# EAGLE design 14145^4 (EAGLE 7.6.0)
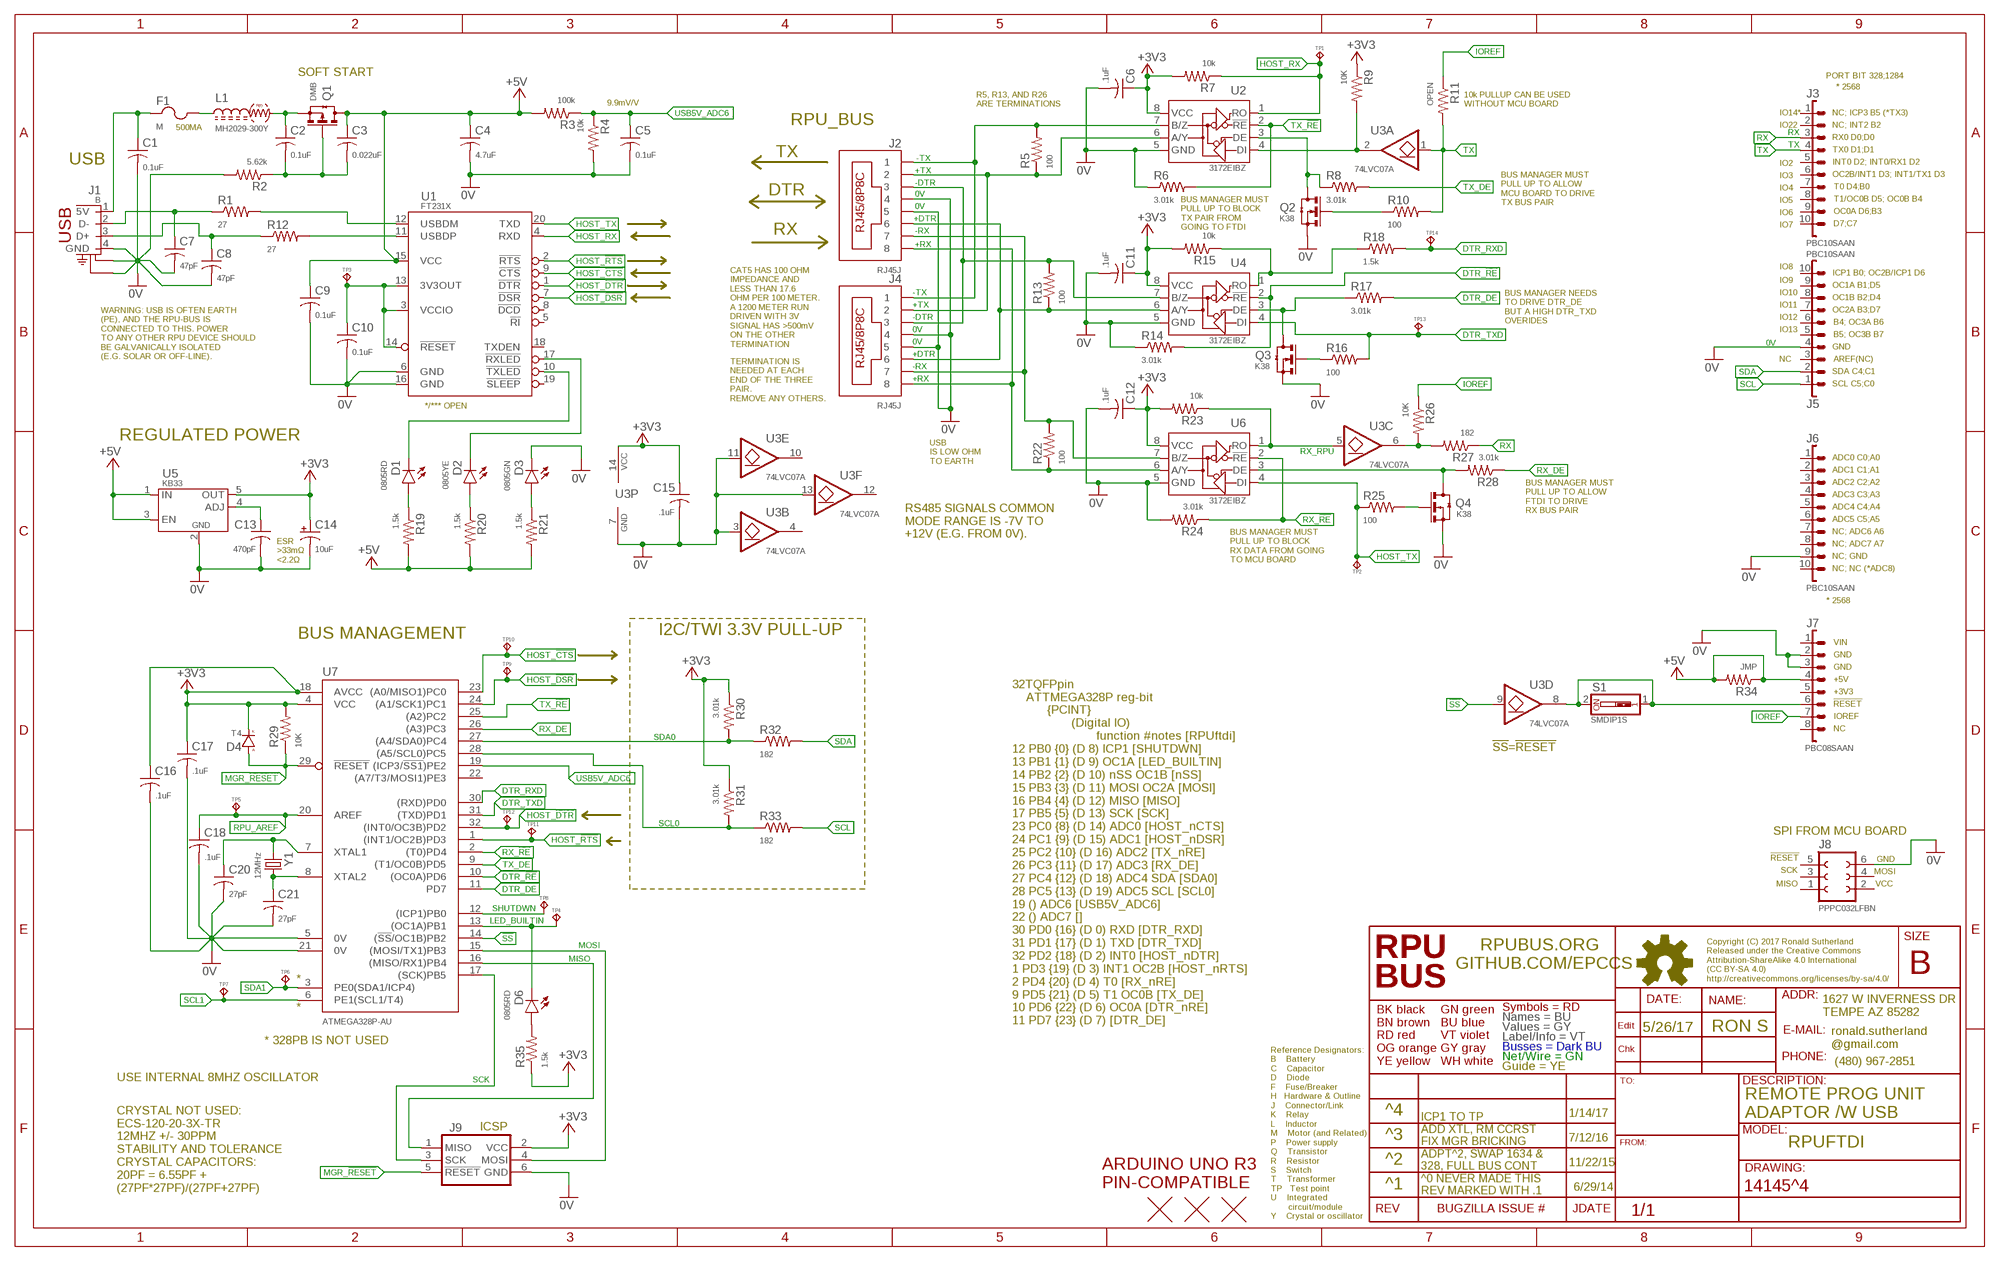
[diagram p0: schematic, sheet 1]

## Parts
C1  0.1uF  CC0603A  [C0603(1608)]
C2  0.1uF  CC0603A  [C0603(1608)]
C3  0.022uF  CC0603A  [C0603(1608)]
C4  4.7uF  CC1206  [C1206(3216)]
C5  0.1uF  CC0603A  [C0603(1608)]
C6  .1uF  CC0603A  [C0603(1608)]
C7  47pF  CC0603A  [C0603(1608)]
C8  47pF  CC0603A  [C0603(1608)]
C9  0.1uF  CC0603A  [C0603(1608)]
C10  0.1uF  CC0603A  [C0603(1608)]
C11  .1uF  CC0603A  [C0603(1608)]
C12  .1uF  CC0603A  [C0603(1608)]
C13  470pF  CC0603A  [C0603(1608)]
C14  10uF  CT1206  [3216]
C15  .1uF  CC0603A  [C0603(1608)]
C16  .1uF  CC0603A  [C0603(1608)]
C17  .1uF  CC0603A  [C0603(1608)]
C18  .1uF  CC0603A  [C0603(1608)]
C20  27pF  CC0603A  [C0603(1608)]
C21  27pF  CC0603A  [C0603(1608)]
D1  0805RD  LEDC0805(2012)  [C0805(2012)]
D2  0805YE  LEDC0805(2012)  [C0805(2012)]
D3  0805GN  LEDC0805(2012)  [C0805(2012)]
D4  T4  DSOD123  [SOD123]
D6  0805RD  LEDC0805(2012)  [C0805(2012)]
F1  M  SMD1210  [C1210(3225)]
J1  B  [USB-B-PTH]
J2  RJ45J  RJ45-8HZT  [RJ45-8HZT]
J3  PBC10SAAN  1X10"  [1X10]
J4  RJ45J  RJ45-8HZT  [RJ45-8HZT]
J5  PBC10SAAN  1X10"  [1X10]
J6  PBC10SAAN  1X10"  [1X10]
J7  PBC08SAAN  1X8"  [1X8]
J8  PPPC032LFBN  F2X3  [F2X3]
J9  ISP-SPIPTH  [ISP]
L1  MH2029-300Y  L0805  [C0805(2012)]
Q1  DMB  N-CHSOT23  [SOT23]
Q2  K38  N-CHSOT23  [SOT23]
Q3  K38  N-CHSOT23  [SOT23]
Q4  K38  N-CHSOT23  [SOT23]
R1  27  R0805  [C0805(2012)]
R2  5.62k  R0805  [C0805(2012)]
R3  100k  R0805  [C0805(2012)]
R4  10k  R0805  [C0805(2012)]
R5  100  R0805  [C0805(2012)]
R6  3.01k  R0805  [C0805(2012)]
R7  10k  R0805  [C0805(2012)]
R8  3.01k  R0805  [C0805(2012)]
R9  10K  R0805  [C0805(2012)]
R10  100  R0805  [C0805(2012)]
R11  OPEN  R0805  [C0805(2012)]
R12  27  R0805  [C0805(2012)]
R13  100  R0805  [C0805(2012)]
R14  3.01k  R0805  [C0805(2012)]
R15  10k  R0805  [C0805(2012)]
R16  100  R0805  [C0805(2012)]
R17  3.01k  R0805  [C0805(2012)]
R18  1.5k  R0805  [C0805(2012)]
R19  1.5k  R0805  [C0805(2012)]
R20  1.5k  R0805  [C0805(2012)]
R21  1.5k  R0805  [C0805(2012)]
R22  100  R0805  [C0805(2012)]
R23  10k  R0805  [C0805(2012)]
R24  3.01k  R0805  [C0805(2012)]
R25  100  R0805  [C0805(2012)]
R26  10K  R0805  [C0805(2012)]
R27  182  R0805  [C0805(2012)]
R28  3.01k  R0805  [C0805(2012)]
R29  10K  R0805  [C0805(2012)]
R30  3.01k  R0805  [C0805(2012)]
R31  3.01k  R0805  [C0805(2012)]
R32  182  R0805  [C0805(2012)]
R33  182  R0805  [C0805(2012)]
R34  JMP  R0805  [C0805(2012)]
R35  1.5k  R0805  [C0805(2012)]
S1  SMDIP1S  SW_DIP-1SMD  [SMD-DIPSWITCH-1]
TP1  TPPAD1-08  [P1-08]
TP2  TPPAD1-08  [P1-08]
TP3  TPPAD1-08  [P1-08]
TP4  TPPAD1-08  [P1-08]
TP5  TPPAD1-08  [P1-08]
TP6  TPPAD1-08  [P1-08]
TP7  TPPAD1-08  [P1-08]
TP8  TPPAD1-08  [P1-08]
TP9  TPPAD1-08  [P1-08]
TP10  TPPAD1-08  [P1-08]
TP11  TPPAD1-08  [P1-08]
TP12  TPPAD1-08  [P1-08]
TP13  TPPAD1-08  [P1-08]
TP14  TPPAD1-08  [P1-08]
U1  FT231X  [20SSOP]
U2  3172EIBZ  ISL3172EIBZ  [SOIC8]
U3  74LVC07A  7407D  [14SOIC]
U4  3172EIBZ  ISL3172EIBZ  [SOIC8]
U5  KB33  MIC5205  [SOT23-5,SOT25]
U6  3172EIBZ  ISL3172EIBZ  [SOIC8]
U7  ATMEGA328P-AU  ATMEGA328PB-AU  [TQFP32-08]
U$1  ARDUINO-UNO  [ARDUINO_UNO]
U$2  FIDUCIAL1.27  [FIDUCIAL-1.27]
U$3  FIDUCIAL1.27  [FIDUCIAL-1.27]
U$4  FIDUCIAL1.27  [FIDUCIAL-1.27]
Y1  12MHz  CSM-3X  [CSM-3X]

## Nets
0V: C1.2 C4.2 C5.2 C6.2 C7.2 C8.2 C9.2 C10.2 C11.2 C12.2 C13.2 C14.- C15.2 C16.2 C17.2 C18.2 C20.2 C21.2 D3.K J1.4(GND) J1.S1(CHASSIS1) J1.S2(CHASSIS2) J2.4 J2.5 J4.4 J4.5 J5.4 J6.9 J7.2 J7.3 J8.6 J9.6(GND) Q2.2(S)(S) Q3.2(S)(S) Q4.2(S)(S) R2.2 R4.2 R6.1 R14.1 R24.2 U1.6(GND) U1.16(GND) U2.5(GND) U3.3(B:I) U3.7(P:GND) U3.11(E:I) U3.13(F:I) U4.5(GND) U5.2(GND) U6.5(GND) U7.5(0V) U7.21(0V)
!SS!: U3.9(D:I) U7.14((!SS!/OC1B)PB2)
+3V3: C6.1 C11.1 C12.1 C14.+ C15.1 C16.1 C17.1 D4.C(K) J9.2(VCC) R7.2 R9.1 R15.2 R23.2 R29.2 R30.1 R31.1 R35.1 U2.8(VCC) U3.14(P:VCC) U4.8(VCC) U5.5(OUT) U6.8(VCC) U7.4(VCC) U7.18(AVCC)
+5V: C3.1 C4.1 C9.1 J7.4 Q1.3(D)(D) R3.2 R19.2 R20.2 R21.2 R34.1 R34.2 U1.15(VCC) U5.1(IN) U5.3(EN)
+DTR: J2.6 J4.6 R13.1 U4.6(A/Y)
+RX: J2.8 J4.8 R22.1 U6.6(A/Y)
+TX: J2.2 J4.2 R5.1 U2.6(A/Y)
-DTR: J2.3 J4.3 R13.2 U4.7(B/Z)
-RX: J2.7 J4.7 R22.2 U6.7(B/Z)
-TX: J2.1 J4.1 R5.2 U2.7(B/Z)
D+: C8.1 J1.3(D+) R12.1
D-: C7.1 J1.2(D-) R1.1
DTR_!RE: R14.2 U4.2(!RE) U7.10((OC0A)PD6)
DTR_DE: R17.2 U7.11(PD7)
DTR_RXD: R18.2 TP14.TP U7.30((RXD)PD0)
DTR_TXD: R16.2 TP13.TP U4.4(DI) U7.31((TXD)PD1)
FT3V3: C10.1 TP3.TP U1.3(VCCIO) U1.13(3V3OUT) U1.14(!RESET!)
HOST_!CTS: TP10.TP U1.9(!CTS!) U7.23((A0/MISO1)PC0)
HOST_!DSR: TP9.TP U1.7(!DSR!) U7.24((A1/SCK1)PC1)
HOST_!DTR: TP12.TP U1.1(!DTR!) U7.32((INT0/OC3B)PD2)
HOST_!RTS: TP11.TP U1.2(!RTS!) U7.1((INT1/OC2B)PD3)
HOST_RX: R7.1 TP1.TP U1.4(RXD) U2.1(RO)
HOST_TX: R25.1 TP2.TP U1.20(TXD) U6.4(DI)
IOREF: J7.7 R11.1 R26.1
LED_BUILTIN: D6.K TP4.TP U7.13((OC1A)PB1)
MGR_!RESET: D4.A J9.5(!RESET) R29.1 U7.29(!RESET)
MISO: J9.1(MISO) U7.16((MISO/RX1)PB4)
MOSI: J9.4(MOSI) U7.15((MOSI/TX1)PB3)
N$3: J7.6 S1.1 S1.2 U3.8(D:O)
N$4: C1.1 F1.1 J1.1(5V)
N$5: F1.2 L1.1
N$6: D2.A R20.1
N$7: D1.K U1.10(!TXLED)
N$8: D2.K U1.17(!RXLED)
N$10: R26.2 R27.2 U3.6(C:O)
N$11: Q4.3(D)(D) R28.2 U6.3(DE)
N$12: R1.2 U1.12(USBDM)
N$13: R12.2 U1.11(USBDP)
N$14: D3.A R21.1
N$15: Q2.1(G)(G) R10.1
N$16: D1.A R19.1
N$18: Q2.3(D)(D) R8.1 U2.3(DE)
N$19: R15.1 R18.1 U4.1(RO)
N$20: Q3.3(D)(D) R17.1 U4.3(DE)
N$22: Q3.1(G)(G) R16.1
N$24: C13.1 U5.4(ADJ)
N$25: Q4.1(G)(G) R25.2
N$26: C2.1 L1.2 Q1.2(S)(S)
N$27: C2.2 C3.2 Q1.1(G)(G) R2.1
N$29: D6.A R35.2
RPU_AREF: C18.1 TP5.TP U7.20(AREF)
RX: J3.3 R27.1
RX_!RE: R24.1 U6.2(!RE) U7.2((T0)PD4)
RX_DE: R28.1 U7.26((A3)PC3)
RX_RPU: R23.1 U3.5(C:I) U6.1(RO)
SCK: J9.3(SCK) U7.17((SCK)PB5)
SCL: J5.1 R33.2
SCL0: R31.2 R33.1 U7.28((A5/SCL0)PC5)
SCL1: TP7.TP U7.6(PE1(SCL1/T4))
SDA: J5.2 R32.2
SDA0: R30.2 R32.1 U7.27((A4/SDA0)PC4)
SDA1: TP6.TP U7.3(PE0(SDA1/ICP4))
SHUTDWN: TP8.TP U7.12((ICP1)PB0)
TX: J3.4 R10.2 R11.2 U3.1(A:I)
TX_!RE: R6.2 U2.2(!RE) U7.25((A2)PC2)
TX_DE: R8.2 U7.9((T1/OC0B)PD5)
TX_RPU: R9.2 U2.4(DI) U3.2(A:O)
USB5V_ADC6: C5.1 R3.1 R4.1 U7.19((ICP3/!SS1!)PE2)
XTAL1: C20.1 U7.7(XTAL1) Y1.1
XTAL2: C21.1 U7.8(XTAL2) Y1.2
Unconnected: J3.1 J3.2 J3.5 J3.6 J3.7 J3.8 J3.9 J3.10 J5.3 J5.5 J5.6 J5.7 J5.8 J5.9 J5.10 J6.1 J6.2 J6.3 J6.4 J6.5 J6.6 J6.7 J6.8 J6.10 J7.1 J7.5 J7.8 J8.1 J8.2 J8.3 J8.4 J8.5 U1.5(!RI!) U1.8(!DCD!) U1.18(TXDEN) U1.19(!SLEEP) U3.4(B:O) U3.10(E:O) U3.12(F:O) U7.22((A7/T3/MOSI1)PE3)

## Notes on the sheet
- SOFT START
- PORT BIT 328;1284
- * 2568
- 9.9mV/V
- R5, R13, AND R26
  ARE TERMINATIONS
- 10k PULLUP CAN BE USED 
  WITHOUT MCU BOARD
- IO14* | NC; ICP3 B5 (*TX3)
- RPU_BUS | IO22 | NC; INT2 B2
- 500MA
- RX0 D0;D0
- TX0 D1;D1
- TX
- USB | IO2 | INT0 D2; INT0/RX1 D2
- IO3 | OC2B/INT1 D3; INT1/TX1 D3
- IO4 | T0 D4;B0
- DTR
- IO5 | T1/OC0B D5; OC0B B4
- BUS MANAGER MUST
  PULL UP TO ALLOW 
  MCU BOARD TO DRIVE
  TX BUS PAIR
- IO6 | OC0A D6;B3
- IO7 | D7;C7
- BUS MANAGER MUST
  PULL UP TO BLOCK 
  TX PAIR FROM 
  GOING TO FTDI
- RX
- IO8
- ICP1 B0; OC2B/ICP1 D6
- IO9
- OC1A B1;D5
- IO10
- OC1B B2;D4
- IO11
- OC2A B3;D7
- IO12
- BUS MANAGER NEEDS
  TO DRIVE DTR_DE
  BUT A HIGH DTR_TXD
  OVERIDES
- B4; OC3A B6
- IO13
- B5; OC3B B7
- CAT5 HAS 100 OHM 
  IMPEDANCE AND 
  LESS THAN 17.6 
  OHM PER 100 METER. 
  A 1200 METER RUN
  DRIVEN WITH 3V 
  SIGNAL HAS >500mV
  ON THE OTHER
  TERMINATION
- GND
- WARNING: USB IS OFTEN EARTH 
  (PE), AND THE RPU-BUS IS 
  CONNECTED TO THIS. POWER 
  TO ANY OTHER RPU DEVICE SHOULD
  BE GALVANICALLY ISOLATED 
  (E.G. SOLAR OR OFF-LINE).
- NC | AREF(NC)
- SDA C4;C1
- SCL C5;C0
- TERMINATION IS 
  NEEDED AT EACH
  END OF THE THREE 
  PAIR.
  REMOVE ANY OTHERS.
- */*** OPEN
- REGULATED POWER
- ADC0 C0;A0
- USB
  IS LOW OHM
  TO EARTH
- ADC1 C1;A1
- ADC2 C2;A2
- ADC3 C3;A3
- ADC4 C4;A4
- BUS MANAGER MUST
  PULL UP TO ALLOW 
  FTDI TO DRIVE
  RX BUS PAIR
- ADC5 C5;A5
- NC; ADC6 A6
- RS485 SIGNALS COMMON 
  MODE RANGE IS -7V TO 
  +12V (E.G. FROM 0V).
- NC; ADC7 A7
- NC; GND
- ESR
  >33mΩ
  <2.2Ω
- BUS MANAGER MUST
  PULL UP TO BLOCK 
  RX DATA FROM GOING
  TO MCU BOARD
- NC; NC (*ADC8)
- * 2568
- BUS MANAGEMENT | I2C/TWI 3.3V PULL-UP
- VIN
- GND
- GND
- +5V
- +3V3
- !RESET
- IOREF
- NC
- !SS!=!RESET!
- SPI FROM MCU BOARD
- !RESET
- GND
- SCK
- MOSI
- MISO
- VCC
- *
- *
- 32TQFPpin
      ATTMEGA328P reg-bit
            {PCINT}
                   (Digital IO)
                          function #notes [RPUftdi]
  12 PB0 {0} (D 8) ICP1 [SHUTDWN]
  13 PB1 {1} (D 9) OC1A [LED_BUILTIN]
  14 PB2 {2} (D 10) nSS OC1B [nSS]
  15 PB3 {3} (D 11) MOSI OC2A [MOSI]
  16 PB4 {4} (D 12) MISO [MISO]
  17 PB5 {5} (D 13) SCK [SCK]
  23 PC0 {8} (D 14) ADC0 [HOST_nCTS]
  24 PC1 {9} (D 15) ADC1 [HOST_nDSR]
  25 PC2 {10} (D 16) ADC2 [TX_nRE]
  26 PC3 {11} (D 17) ADC3 [RX_DE]
  27 PC4 {12} (D 18) ADC4 SDA [SDA0]
  28 PC5 {13} (D 19) ADC5 SCL [SCL0]
  19 () ADC6 [USB5V_ADC6]
  22 () ADC7 []
  30 PD0 {16} (D 0) RXD [DTR_RXD]
  31 PD1 {17} (D 1) TXD [DTR_TXD]
  32 PD2 {18} (D 2) INT0 [HOST_nDTR]
  1 PD3 {19} (D 3) INT1 OC2B [HOST_nRTS]
  2 PD4 {20} (D 4) T0 [RX_nRE]
  9 PD5 {21} (D 5) T1 OC0B [TX_DE]
  10 PD6 {22} (D 6) OC0A [DTR_nRE]
  11 PD7 {23} (D 7) [DTR_DE]
- 5/26/17 | RON S
- * 328PB IS NOT USED
- USE INTERNAL 8MHZ OSCILLATOR
- ^4 | 1/14/17
- REMOTE PROG UNIT
  ADAPTOR /W USB
- ICP1 TO TP
- ICSP
- ^3 | 7/12/16
- ADD XTL, RM CCRST
  FIX MGR BRICKING
- RPUFTDI
- ^2 | 11/22/15
- ADPT^2, SWAP 1634 &
  328, FULL BUS CONT
- ^1 | 6/29/14
- CRYSTAL NOT USED:
  ECS-120-20-3X-TR 
  12MHZ +/- 30PPM
  STABILITY AND TOLERANCE
  CRYSTAL CAPACITORS:
  20PF = 6.55PF +
  (27PF*27PF)/(27PF+27PF)
- ^0 NEVER MADE THIS
  REV MARKED WITH .1

## Library data of the parts
C1-C13 C15-C18 C20 C21 = C-C:C: CAPACITOR Symbol
C14 = C-T:CT: Tantalum Electrolytic Capacitor
D1-D3 D6 = D-LED:LED: LED 120120WH [CREE,XHGAWT-00-0000-00000HXE1] LED WHITE 6500K 150LUM-W120120
D4 = D-GP:D: DIODE
F1 = F-RST:SMD: Fuse i.e. Bourns, MF-USMF075-2
J1 = J-USB:B: B [MOLEX,0670688000] USB B THROUGH HOLE
J2 J4 = J-RJ45:RJ45-8: RJ45 Jack RJ45J [ASSMANN,A-2014-2-4-R] JACK MODULAR VERT PCB 8P8C UNSHIELD Horz version form sparkfun sku PRT-00643, and breakout board sku is BOB-00716.
J3 J5 J6 = J-HDR2.54mm:1X10: 10 POS HEADER PBC10S [SULLINS,PBC10SAAN]HEADER MALE BRKWAY 10POS .1IN AA
J7 = J-HDR2.54mm:1X8: 8 POS HEADER PBC08SAAN [SULLINS,PBC08SAAN]HEADER MALE BRKWAY 8POS .1IN AA
J8 = J-HDR2.54mm:F2X3: FEMALE HEADER 2X3POS
J9 = U-AVR:ISP-SPI: AVR ISP thru SPI In-System Programming uses the target Atmel AVR’s internal SPI (Serial Peripheral Interface) to download code into the flash and EEPROM memories. It is not a debugging interface. When designing an application PCB which includes an AVR with the SPI interface, this pinout should be used. Sparkfun SKU: BOB-08508
L1 = L-FB:L: Ferrite Bead with frequency dependent resistance
Q1 = Q-PCH:N-CH?*: ENHANCEMENT MODE MOSFET SOT23 is BSS138 pinout
Q2-Q4 = Q-NCH:N-CH?*: ENHANCEMENT MODE MOSFET SOT23 is BSS138 pinout
R1-R35 = R-C:R: Resiistor American-style symbol
S1 = S-Toggle:SW_DIP-1
TP1-TP14 = J-TP:TP: Test pad
U1 = U-Transceiver:FT231X
U2 U4 U6 = U-Transceiver:ISL3172E: TRANSCEIVER RS485 3.3V HALFDPLX
U3 = U-7400:74*07: HEX BUFFER, OPEN DRAIN/COLLECTOR 74LVC07A [DIODES,74LVC07AS14-13] LOGIC BUFFER OPEN DRAIN 14SOIC
U5 = P-DCDC:MIC5205: KB33 [MICREL,MIC5205-3.3YM5] REG ULDO 3V3 150MA SOT23-5
U7 = U-AVR:ATMEGA328PB-AU: ATmega328PB 4 Kbytes FLASH 128 bytes SRAM 256 bytes EEPROM 2 UART, 2 I2C, 2 SPI 8-channel 10 bit ADC
U$1 = J-BoardHDR:ARDUINO-UNO: Board Outline with holes and silk note the board dim layer is not defined
U$2-U$4 = H-Fiducial:FIDUCIAL: Fiducial Alignment Points Various fiducial points for machine vision alignment.
Y1 = Y-XTL:CSM: 16MHZ20 [ECS,ECS-160-20-3X-TR] CRYSTAL 16MHZ 20PF 30PPM CSM-3X

## Net classes
0 default: width 0.254 mm, drill 0.33 mm

## Board
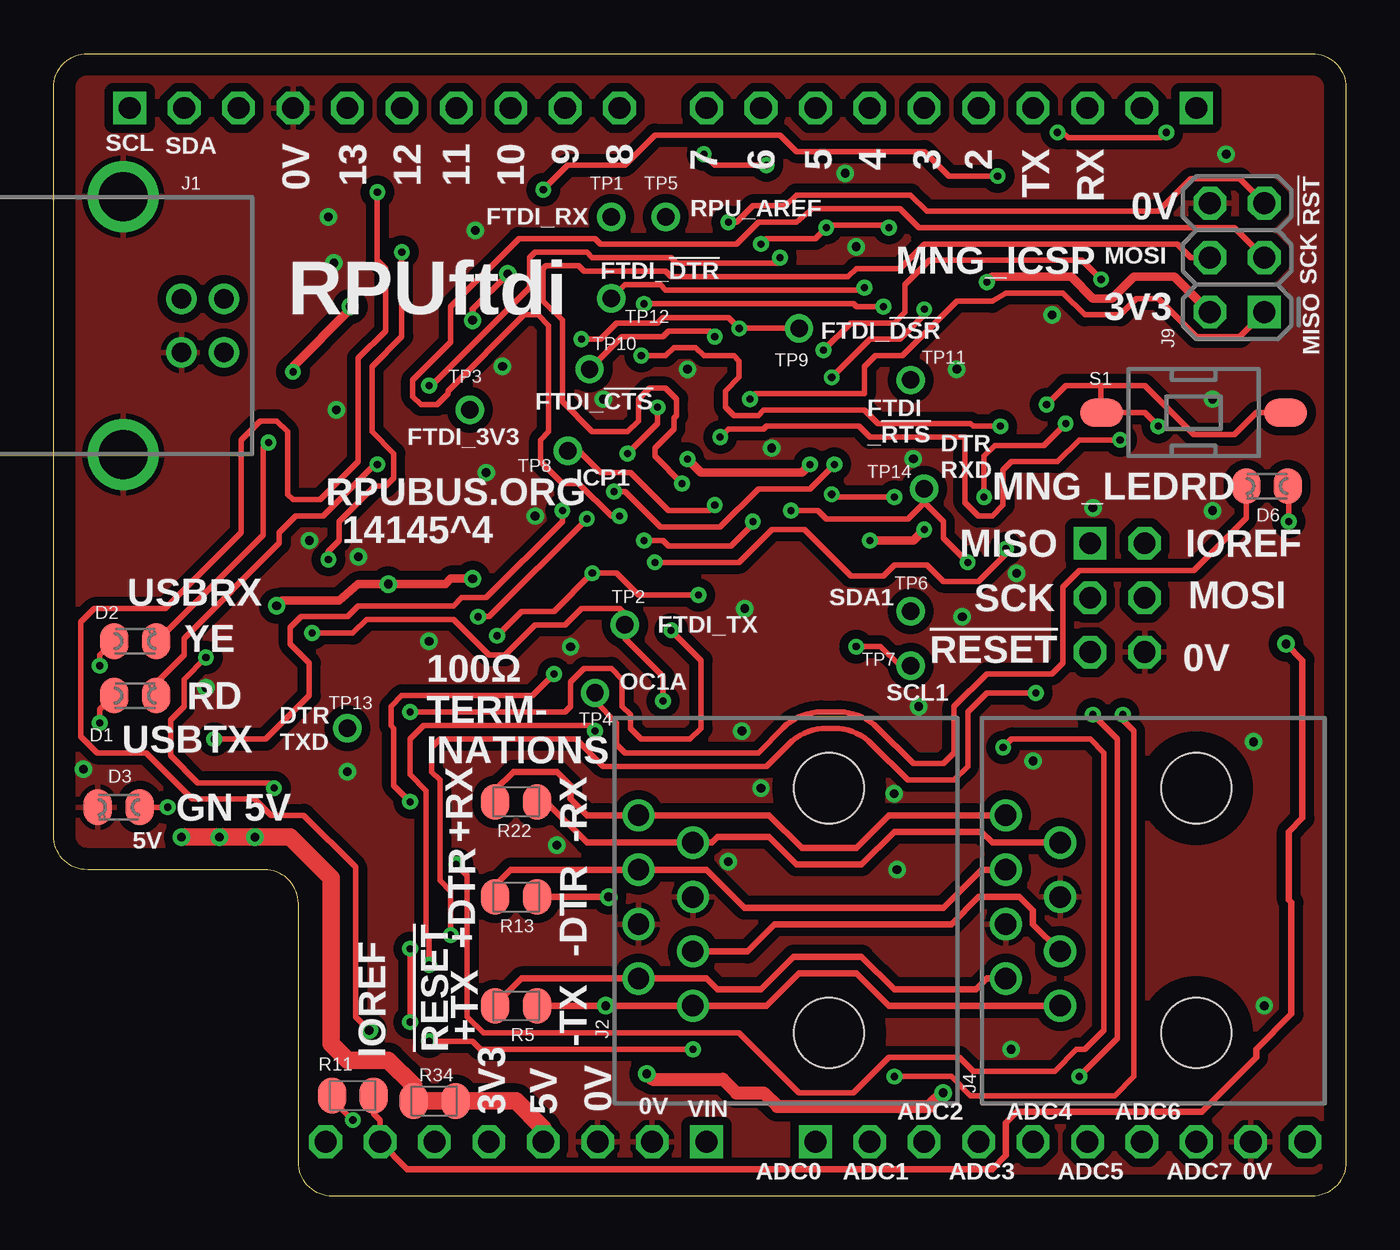
[diagram p1: board, top side]
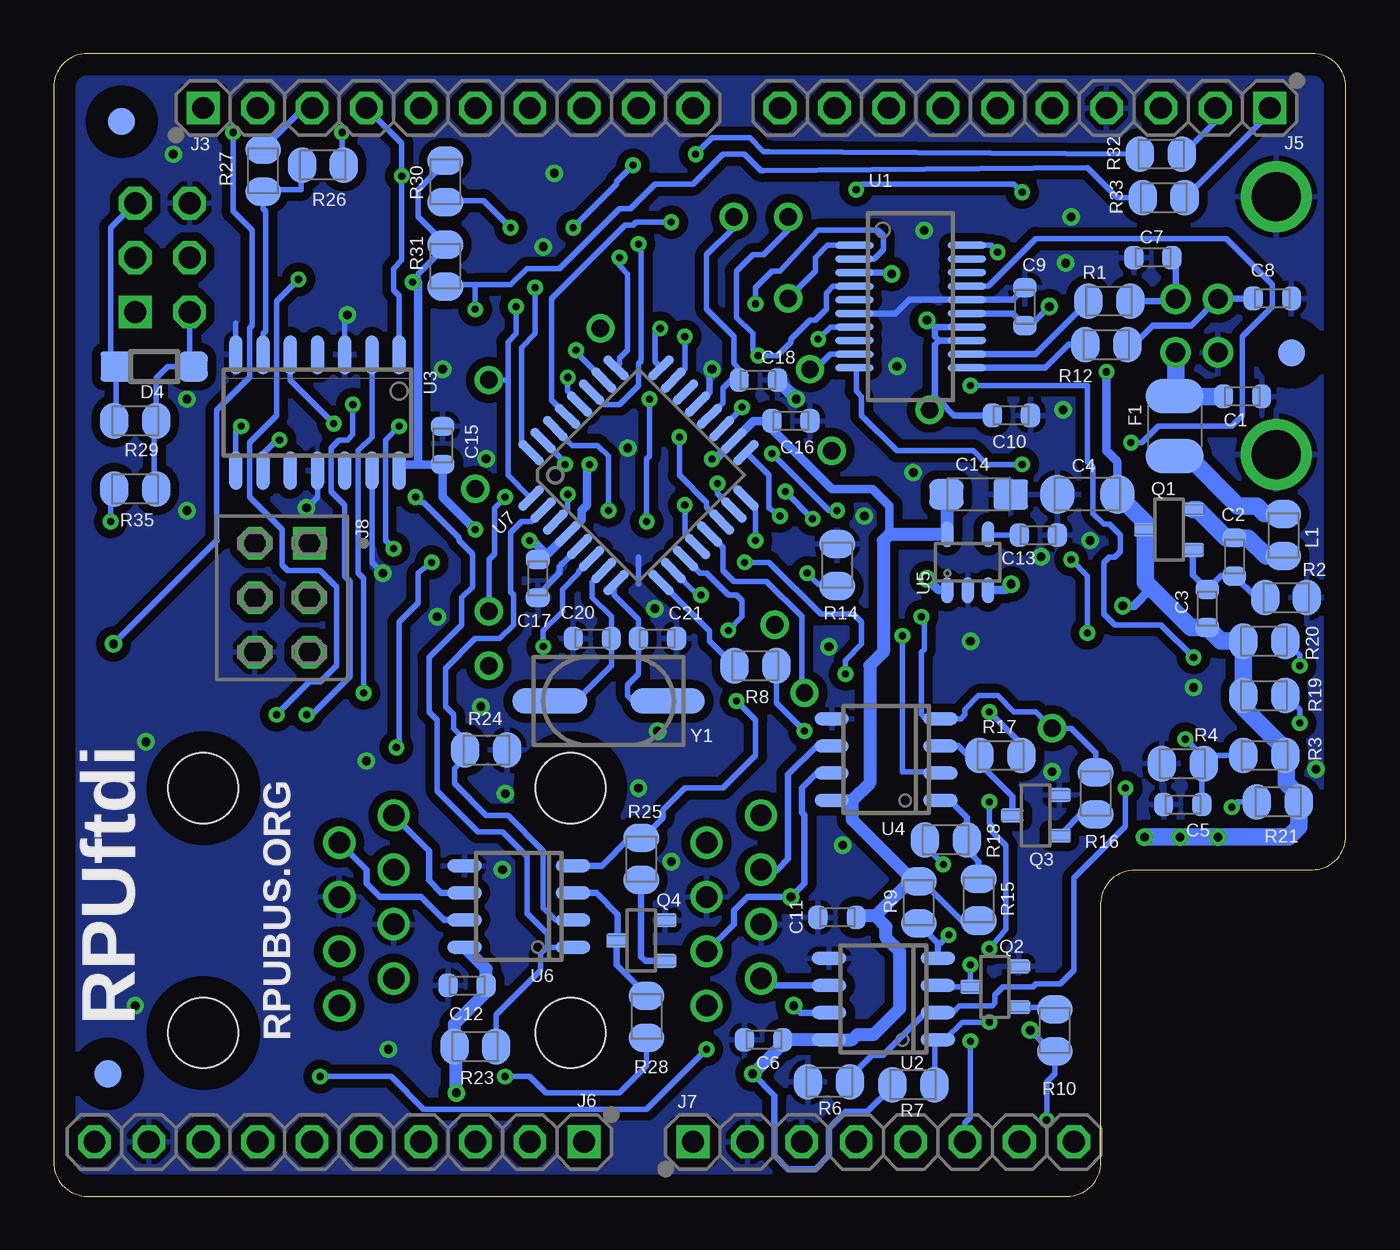
[diagram p2: board, bottom side, seen from below]

Size 60.33 x 53.34 mm. Coordinates in mm from the lower left corner, seen from the top.
Outline: 60.33,51.75 60.33,1.59 arc-90 58.74,0 13.02,0 arc-90 11.43,1.59 11.43,13.65 arc90 9.84,15.24 1.59,15.24 arc-90 0,16.83 0,51.75 arc-90 1.59,53.34 58.74,53.34 arc-90 60.33,51.75
Copper layers (1*16): Top 0.034290625mm / dielectric 60mil / Bottom 0.034290625mm
Design rules "default *": minimum track width 10mil, minimum drill 13mil, track to track 8mil, track to pad 8mil, pad to pad 8mil, via to via 8mil, smd to smd 8mil, copper to edge 40mil, drill to drill 12mil, minimum pad ring 10mil, minimum via ring 8mil, stop-mask expansion 4mil, vias tented up to drill 17mil, thermal gap 10mil

### Footprints (pad centres in the part's own frame; a part is rotated, then mirrored left to right if it is on the bottom)
C0603(1608) = smd 0.898 x 1.1: 1 -0.889,0; 2 0.889,0
C1206(3216) = smd 1.6 x 1.8: 1 -1.4,0; 2 1.4,0
3216 = smd 1.6 x 1.4: + -1.5,0; - 1.5,0
C0805(2012) = smd 1.321 x 1.651: A 0.977,0; K -0.977,0
SOD123 = smd 1.4 x 1.4: A 1.8,0; C -1.8,0
C1210(3225) = smd 1.6 x 2.7: 1 -1.4,0; 2 1.4,0
USB-B-PTH = drill 0.914: 1 1.981,-1.25; 2 1.981,1.25; 3 0,1.25; 4 0,-1.25 | drill 2.286: S1 -2.718,-6.02; S2 -2.718,6.02
RJ45-8HZT = drill 1: 1 -4.445,6.35; 2 -3.175,8.89; 3 -1.905,6.35; 4 -0.635,8.89; 5 0.635,6.35; 6 1.905,8.89; 7 3.175,6.35; 8 4.445,8.89 | hole 3.264: -5.715,0; 5.715,0
1X10 = drill 1.016 square: 1 0,0 | drill 1.016 octagon: 2 2.54,0; 3 5.08,0; 4 7.62,0; 5 10.16,0; 6 12.7,0; 7 15.24,0; 8 17.78,0; 9 20.32,0; 10 22.86,0
1X8 = drill 1.016 square: 1 0,0 | drill 1.016 octagon: 2 2.54,0; 3 5.08,0; 4 7.62,0; 5 10.16,0; 6 12.7,0; 7 15.24,0; 8 17.78,0
F2X3 = drill 1.016 square: 1 0,0 | drill 1.016 octagon: 2 0,-2.54; 3 2.54,0; 4 2.54,-2.54; 5 5.08,0; 6 5.08,-2.54
ISP = drill 1.016 square: 1 0,0 | drill 1.016 octagon: 2 0,2.54; 3 2.54,0; 4 2.54,2.54; 5 5.08,0; 6 5.08,2.54
C0805(2012)' = smd 1.321 x 1.651: 1 -0.977,0; 2 0.977,0
SOT23 = smd 0.65 x 1.06: 1(G) -0.95,-1.1; 2(S) 0.95,-1.1; 3(D) 0,1.1
SMD-DIPSWITCH-1 = smd 1.3 x 2: 1 0,-4.3; 2 0,4.3
P1-08 = drill 0.813: TP 0,0
20SSOP = smd 0.33 x 1.8: 1 -2.857,-2.625; 2 -2.223,-2.625; 3 -1.587,-2.625; 4 -0.953,-2.625; 5 -0.318,-2.625; 6 0.318,-2.625; 7 0.953,-2.625; 8 1.587,-2.625; 9 2.223,-2.625; 10 2.857,-2.625; 11 2.857,2.625; 12 2.223,2.625; 13 1.587,2.625; 14 0.953,2.625; 15 0.318,2.625; 16 -0.318,2.625; 17 -0.953,2.625; 18 -1.587,2.625; 19 -2.223,2.625; 20 -2.857,2.625
SOIC8 = smd 0.6 x 1.6: 1 -1.905,-2.54; 2 -0.635,-2.54; 3 0.635,-2.54; 4 1.905,-2.54; 5 1.905,2.54; 6 0.635,2.54; 7 -0.635,2.54; 8 -1.905,2.54
14SOIC = smd 0.6 x 1.8: 1 -3.81,-2.7; 2 -2.54,-2.7; 3 -1.27,-2.7; 4 0,-2.7; 5 1.27,-2.7; 6 2.54,-2.7; 7 3.81,-2.7; 8 3.81,2.7; 9 2.54,2.7; 10 1.27,2.7; 11 0,2.7; 12 -1.27,2.7; 13 -2.54,2.7; 14 -3.81,2.7
SOT23-5,SOT25 = smd 0.55 x 1.2: 1 -0.95,-1.3; 2 0,-1.3; 3 0.95,-1.3; 4 0.95,1.3; 5 -0.95,1.3
TQFP32-08 = smd 1.5 x 0.45: 1 -4.293,2.8; 2 -4.293,2; 3 -4.293,1.2; 4 -4.293,0.4; 5 -4.293,-0.4; 6 -4.293,-1.2; 7 -4.293,-2; 8 -4.293,-2.8; 17 4.293,-2.8; 18 4.293,-2; 19 4.293,-1.2; 20 4.293,-0.4; 21 4.293,0.4; 22 4.293,1.2; 23 4.293,2; 24 4.293,2.8 | smd 0.45 x 1.5: 9 -2.8,-4.293; 10 -2,-4.293; 11 -1.2,-4.293; 12 -0.4,-4.293; 13 0.4,-4.293; 14 1.2,-4.293; 15 2,-4.293; 16 2.8,-4.293; 25 2.8,4.293; 26 2,4.293; 27 1.2,4.293; 28 0.4,4.293; 29 -0.4,4.293; 30 -1.2,4.293; 31 -2,4.293; 32 -2.8,4.293
FIDUCIAL-1.27 = smd 1.27 x 1.27: 1 0,0
CSM-3X = smd 3.5 x 1.2: 1 -2.75,0; 2 2.75,0

### Placement (x,y rotation side)
C1  4.83,37.34 0 bottom
C2  5.21,29.84 270 bottom
C3  6.48,27.43 90 bottom
C4  12.06,32.77 180 bottom
C5  7.62,18.29 180 bottom
C6  27.18,7.3 180 bottom
C7  9.02,43.81 180 bottom
C8  3.43,41.91 0 bottom
C9  14.99,41.53 90 bottom
C10  15.62,36.45 0 bottom
C11  23.75,13.02 180 bottom
C12  41.02,9.84 180 bottom
C13  14.35,30.86 0 bottom
C14  17.14,32.77 0 bottom
C15  42.16,35.05 90 bottom
C16  25.91,36.2 0 bottom
C17  37.72,28.83 270 bottom
C18  27.43,38.1 0 bottom
C20  35.18,26.04 180 bottom
C21  32.13,26.04 0 bottom
D1  3.81,23.37 180 top
D2  3.81,25.91 180 top
D3  3.05,18.16 0 top
D4  55.63,38.73 180 bottom
D6  56.64,33.15 0 top
F1  8,35.94 270 bottom
J1  5.97,40.64 0 top
J2  36.2,13.34 90 top
J3  53.34,50.8 0 bottom
J4  53.34,13.34 90 top
J5  3.56,50.8 180 bottom
J6  35.56,2.54 180 bottom
J7  30.48,2.54 0 bottom
J8  48.39,30.48 270 bottom
J9  56.52,41.27 90 top
L1  MH2029-300Y  [C0805(2012)']  2.92,30.86 270 bottom
Q1  8.26,31.11 90 bottom
Q2  16.38,9.78 90 bottom
Q3  14.48,17.78 90 bottom
Q4  32.89,11.94 90 bottom
R1  27  [C0805(2012)']  11.05,41.78 180 bottom
R2  5.62k  [C0805(2012)']  2.79,27.94 0 bottom
R3  100k  [C0805(2012)']  3.81,20.57 0 bottom
R4  10k  [C0805(2012)']  7.62,20.19 180 bottom
R5  100  [C0805(2012)']  21.59,8.89 0 top
R6  3.01k  [C0805(2012)']  24.13,5.33 0 bottom
R7  10k  [C0805(2012)']  20.19,5.21 180 bottom
R8  3.01k  [C0805(2012)']  27.56,24.77 180 bottom
R9  10K  [C0805(2012)']  19.94,13.72 270 bottom
R10  100  [C0805(2012)']  13.59,7.75 270 bottom
R11  OPEN  [C0805(2012)']  13.97,4.7 180 top
R12  27  [C0805(2012)']  11.18,39.75 180 bottom
R13  100  [C0805(2012)']  21.59,13.97 0 top
R14  3.01k  [C0805(2012)']  23.75,29.46 270 bottom
R15  10k  [C0805(2012)']  17.14,13.84 270 bottom
R16  100  [C0805(2012)']  11.68,18.8 90 bottom
R17  3.01k  [C0805(2012)']  16.13,20.57 0 bottom
R18  1.5k  [C0805(2012)']  18.67,16.64 180 bottom
R19  1.5k  [C0805(2012)']  3.81,23.37 180 bottom
R20  1.5k  [C0805(2012)']  3.81,25.91 180 bottom
R21  1.5k  [C0805(2012)']  3.17,18.41 0 bottom
R22  100  [C0805(2012)']  21.59,18.41 0 top
R23  10k  [C0805(2012)']  40.64,6.99 180 bottom
R24  3.01k  [C0805(2012)']  40.13,20.83 0 bottom
R25  100  [C0805(2012)']  32.89,15.75 270 bottom
R26  10K  [C0805(2012)']  47.75,48.13 180 bottom
R27  182  [C0805(2012)']  50.55,47.88 270 bottom
R28  3.01k  [C0805(2012)']  32.64,8.38 90 bottom
R29  10K  [C0805(2012)']  56.52,36.2 0 bottom
R30  3.01k  [C0805(2012)']  42.04,47.37 270 bottom
R31  3.01k  [C0805(2012)']  42.04,43.43 270 bottom
R32  182  [C0805(2012)']  8.64,48.64 0 bottom
R33  182  [C0805(2012)']  8.51,46.61 0 bottom
R34  JMP  [C0805(2012)']  17.78,4.45 180 top
R35  1.5k  [C0805(2012)']  56.52,33.02 180 bottom
S1  53.21,36.58 90 top
TP1  26.04,45.72 0 top
TP2  26.67,26.67 0 top
TP3  19.43,36.7 0 top
TP4  25.27,23.5 0 top
TP5  28.57,45.72 0 top
TP6  40.01,27.3 0 top
TP7  40.01,24.77 0 top
TP8  24,34.8 0 top
TP9  34.8,40.51 0 top
TP10  25.02,38.61 0 top
TP11  40.01,38.1 0 top
TP12  26.04,41.91 0 top
TP13  13.72,21.84 0 top
TP14  40.64,33.02 0 top
U1  20.32,41.53 270 bottom
U2  21.59,9.21 90 bottom
U3  48.01,36.58 180 bottom
U4  21.46,20.38 90 bottom
U5  17.65,29.59 0 bottom
U6  38.61,13.53 90 bottom
U7  33.02,33.66 45 bottom
U$1  -15.24,0 0 top  (outside the outline)
U$2  57.15,50.16 0 bottom
U$3  2.54,39.37 0 bottom
U$4  57.78,5.71 0 bottom
Y1  34.42,23.11 0 bottom

### Tracks (layer width: path | path; a pad name or v marks a point on that pad's centre or on a via)
0V  (via drill 0.41)
  Bottom 0.254: U3.7 51.82,40.77 | U3.3 46.74,41.02 v46.61,41.15 | U3.11 48.01,32.64 v48.51,32.13 | U3.13 45.47,29.59 v44.96,29.08 | 33.02,28.57 33.02,29.84
  Bottom 0.305: C9.2 15.56,41.85 U1.16 20.38,41.85 21.02,41.21 U1.6 | U7.21 29.72,37.52 29.72,38.48 v29.59,38.61 | U7.5 36.7,29.41 36.7,29.08 37.72,28.07 C17.2
  Bottom 0.61: C18.2 v25.65,37.21
  other vias: 14.22,29.84 17.53,25.91 13.72,19.81 13.21,36.7 11.94,30.61 7.11,23.75 20.95,38.73 20.19,33.78 22.48,31.75 12.83,45.72 19.68,45.09 1.4,19.94 24.13,25.65 32.13,21.72 40.39,22.86 33.02,19.05 45.72,20.32 39.37,15.24 56.52,8.89 56.01,21.21 54.1,37.21 54.74,48.64 54.1,32 42.16,38.61 42.42,27.05 40.13,34.42 33.53,34.92 13.08,43.56 31.5,15.62 23.5,16.38 44.7,6.86 32.26,27.43 36.96,47.75 37.47,44.32 39.24,18.8
  pour Top (isolate 0.406): 10.79,0 10.79,14.61 0,14.61 0,53.34 60.33,53.34 60.33,0
  pour Bottom (isolate 0.406): 0,53.34 60.33,53.34 60.33,0 10.79,0 10.79,14.61 0,14.61
!SS!  (via drill 0.33)
  Top 0.254: v31.11,35.43 31.5,35.81 33.15,35.81 33.27,35.94 37.59,35.94 38.1,35.43 42.55,35.43 42.55,32.38 43.18,31.75 43.81,31.75 44.32,32.26 44.32,33.91 44.7,34.29 46.86,34.29 47.88,35.31 v49.78,35.31
  Bottom 0.254: v31.11,35.43 31.11,33.66 29.84,32.38 29.84,32.18 U7.14 | U3.9 50.55,34.67 49.91,35.31 v49.78,35.31
+3V3  (via drill 0.33, 0.41)
  Top 0.406: v38.1,30.61 40.13,30.61 v40.64,31.11 | v43.56,42.67 43.81,42.93 47.5,42.93 48.51,41.91 49.4,41.91 50.42,42.93 52.32,42.93 J9.2 | v29.59,34.42 30.23,33.78 34.92,33.78 v35.31,34.16
  Top 0.61: v27.69,5.71 27.94,5.46 31.24,5.46 31.88,4.83 33.15,4.83 33.78,4.19 40.89,4.19 v41.53,4.83
  Bottom 0.254: R35.1 55.63,33.02 55.63,36.2 R29.2 55.54,38.19 54.99,38.73 D4.C 53.72,38.73 53.98,38.99 J9.2 | 42.04,48.39 R30.1 42.04,48.26 43.31,46.99 43.31,45.72 42.04,44.45 R31.1 42.04,44.32 43.31,43.05 43.31,42.67 | U3.14 44.2,34.16 | 37.34,29.97 37.47,29.97 C17.1
  Bottom 0.305: R9.1 19.77,14.69 17.91,12.83 17.18,12.83 R15.2 | R7.2 21.17,5.12 22.35,3.94 23.37,3.94 24.13,3.17 24.13,1.91 24.77,1.27 26.04,1.27 26.67,1.91 26.67,4.7 v27.69,5.71 | 37.27,29.97 37.34,29.97
  Bottom 0.406: 21.31,30.89 21.31,32.23 22.1,33.02 24,33.02 26.8,35.81 C16.1 27.65,36.2 U7.18 29.43,34.42 v29.59,34.42 | 44.2,34.16 43.31,34.16 | 43.31,34.16 C15.1 42.16,32.64 v40.64,31.11 | v38.1,30.61 37.97,30.61 37.34,29.97 | 43.31,34.16 43.31,42.67 v43.56,42.67 | v35.31,34.16 35.43,34.04 35.43,32.26 35.69,32 35.69,31.55 U7.4 37.27,29.97
  Bottom 0.61: C14.+ 18.6,32.72 U5.5 21.31,30.89 21.59,30.61 21.59,25.4 22.23,24.77 22.23,19.3 23.05,18.48 | U4.8 23.05,18.48 | 23.05,18.48 23.05,17.59 20.15,14.69 | R9.1 20.15,14.69 | 20.15,14.69 20.36,14.69 21.97,13.08 | 21.97,13.08 22.8,13.08 C11.1 | 21.97,13.08 21.46,12.57 21.46,12.06 20.83,11.43 20.83,8.76 22.04,7.56 22.8,7.56 23.05,7.3 U2.8 C6.1 26.29,7.11 v27.69,5.71 | v41.53,4.83 41.53,6.9 R23.2 41.62,8.04 40.13,9.53 C12.1 40.13,10.6 U6.8
+5V  (via drill 0.33, 0.41)
  Top 0.406: v11.18,38.48 11.18,38.73 13.84,41.4 v13.84,41.53 | v19.56,28.83 18.54,28.83 18.29,28.57 v15.62,28.57 14.22,28.57 13.34,27.81 10.67,27.81 v10.41,27.56
  Top 0.813: v5.97,16.76 v7.75,16.76 v9.4,16.76 11.05,16.76 12.95,14.86 12.95,7.11 13.72,6.35 15.62,6.35 16.8,5.17 R34.2 R34.1 21.59,4.45 22.86,3.17 J7.4
  Bottom 0.305: U1.15 15.56,41.21 C9.1 14.73,40.64 v13.84,41.53 | C4.1
  Bottom 0.406: v11.18,38.48 11.18,34.8 10.67,34.29 C4.1 | U5.1 19.02,28.29 v19.56,28.83 | v10.41,27.56 9.91,27.56 9.08,28.38 | U5.3 15.9,28.29 v15.62,28.57
  Bottom 0.813: v9.4,16.76 2.67,16.76 2.2,17.23 R21.2 2.2,18.71 2.79,19.3 2.79,20.45 2.83,20.49 R3.2 2.83,20.87 4.79,22.82 R19.2 R20.2 5.84,25.91 C3.1 7.24,26.54 9.08,28.38 9.36,28.66 Q1.3(D) 9.36,31.46 C4.1
+DTR
  Top 0.305: J4.6 43.31,15.24 41.53,13.46 32.26,13.46 30.48,15.24 J2.6 21.34,15.24 20.61,14.52 R13.1
  Bottom 0.305: U4.6 24.7,21.02 26.04,19.68 26.04,15.75 26.54,15.24 J2.6
+RX
  Top 0.305: J4.8 38.99,17.78 37.47,16.26 34.92,16.26 33.4,17.78 J2.8 24.89,17.78 24.13,18.54 24.13,19.18 23.5,19.81 21.46,19.81 20.61,18.96 R22.1
  Bottom 0.305: U6.6 42.23,14.16 42.8,14.73 42.8,16.13 J4.8
+TX
  Top 0.305: R5.1 20.61,8.93 21.84,10.16 J2.2 30.48,10.16 30.99,9.65 33.02,9.65 34.54,11.18 37.72,11.18 39.24,9.65 43.05,9.65 43.56,10.16 J4.2
  Bottom 0.305: U2.6 26.99,9.84 J2.2
-DTR  (via drill 0.41)
  Top 0.305: J4.3 45.72,12.7 45.72,13.34 45.09,13.97 43.18,13.97 41.91,12.7 33.66,12.7 32.38,11.43 J2.3 | R13.2 v25.91,13.97
  Bottom 0.305: U4.7 24.7,19.75 25.4,19.05 25.4,17.91 25.27,17.78 25.27,14.61 v25.91,13.97 27.94,13.97 28.57,13.34 28.57,12.7 J2.3
-RX
  Top 0.305: J4.7 43.81,16.51 43.31,17.02 39.24,17.02 37.72,15.49 34.67,15.49 33.4,16.76 30.99,16.76 30.73,16.51 J2.7 24.89,16.51 22.99,18.41 R22.2
  Bottom 0.305: U6.7 42.1,12.89 43.18,13.97 45.09,13.97 45.72,14.61 45.72,15.24 J4.7
-TX  (via drill 0.41)
  Top 0.305: R5.2 v25.78,8.89 J2.1 33.27,8.89 34.8,10.41 37.47,10.41 38.99,8.89 J4.1
  Bottom 0.305: U2.7 25.46,8.57 v25.78,8.89
D+
  Bottom 0.305: R12.1 9.91,39.75 9.02,40.64 7.22,40.64 J1.3 4.34,41.89 C8.1
D-
  Bottom 0.305: R1.1 8.06,41.78 J1.2 7.95,43.64 C7.1
DTR_!RE  (via drill 0.33)
  Top 0.254: v30.1,28.07 27.3,28.07 26.29,29.08 v25.15,29.08 23.37,27.3 21.84,27.3 v20.7,26.16
  Bottom 0.254: v25.15,29.08 24.64,28.57 23.88,28.57 R14.2 | v20.7,26.16 20.7,19.81 18.92,19.81 U4.2 | U7.10 30.35,28.16 30.19,28.16 v30.1,28.07
DTR_DE  (via drill 0.33)
  Top 0.254: v16.64,22.61 23.88,22.61 24.13,22.86 24.13,24 24.77,24.64 26.04,24.64 26.54,24.13 26.54,22.86 26.92,22.48 26.92,21.84 27.43,21.34 29.72,21.34 30.23,21.84 30.23,25.02 v28.83,26.42
  Bottom 0.254: v28.83,26.42 28.19,27.05 28.19,27.81 28.45,28.07 28.83,28.07 29.84,29.08 30.14,29.08 U7.11 | v16.64,22.61 15.24,21.21 R17.2
  Bottom 0.305: R17.2 15.15,21.12
DTR_RXD  (via drill 0.33)
  Top 0.254: v34.42,32 35.69,32 36.07,31.62 39.88,31.62 40.64,32.38 | v44.32,20.95 44.7,21.34 48.39,21.34 49.02,20.7 49.02,7.75 48.13,6.86 47.75,6.86 46.74,5.84 42.93,5.84 42.29,6.48 38.99,6.48 37.34,4.83 34.8,4.83 32,7.62 20.07,7.62 19.3,8.38 19.3,14.99 v18.8,15.49 | v42.67,29.59 41.53,30.73 41.53,31.5 40.64,32.38 | TP14.TP 40.64,32.38
  Bottom 0.254: v34.42,32 34.42,34.54 34.92,35.05 36.11,35.05 U7.30 | v42.67,29.59 43.31,29.08 43.31,27.69 44.2,26.8 44.2,21.08 v44.32,20.95 | v18.8,15.49 19.56,16.26 19.56,16.64 R18.2
DTR_TXD  (via drill 0.33)
  Top 0.254: v36.45,34.16 35.31,33.02 32.89,33.02 31.11,31.24 28.32,31.24 26.67,32.89 v26.16,32.89 | v24.89,31.62 20.32,27.05 v19.81,27.05
  Bottom 0.254: v24.89,31.62 v26.16,32.89 | U7.31 36.45,34.26 v36.45,34.16 | R16.2 11.68,20.7 12.83,21.84 TP13.TP 14.48,22.61 15.49,22.61 16.26,23.37 17.14,23.37 17.78,22.73 17.78,22.48 17.97,22.29 U4.4 19.62,22.29 19.81,22.48 19.81,25.4 19.68,25.53 19.68,26.92 v19.81,27.05
  Bottom 0.305: 11.72,20.07 R16.2
FT3V3  (via drill 0.41)
  Top 0.305: v19.56,40.89 19.56,41.4 v21.21,43.05
  Bottom 0.254: TP3.TP 19.3,36.7 18.92,37.08
  Bottom 0.305: C10.1 18.29,36.45 18.92,37.08 19.18,37.34 19.18,39.75 18.99,39.94 | U1.13 18.99,39.94 | U1.14 19.11,40.58 19.18,40.51 | 19.18,40.51 19.18,40.13 18.99,39.94 | 19.18,40.51 v19.56,40.89 | U1.3 21.27,43.12 v21.21,43.05
HOST_!CTS  (via drill 0.33)
  Top 0.254: v30.86,40.13 30.61,40.39 28.7,40.39 28.45,40.13 26.54,40.13 TP10.TP
  Bottom 0.254: U7.23 30.86,38.64 v30.86,40.13 | U1.9 24.07,39.31 24.77,38.61 TP10.TP
HOST_!DSR  (via drill 0.33)
  Top 0.254: v24.64,40.01 25.53,40.01 26.29,40.77 28.19,40.77 28.45,41.02 31.5,41.02 v32,40.51 TP9.TP
  Bottom 0.254: U7.24 32.26,38.96 32.26,40.26 v32,40.51 | U1.7 24.07,40.58 v24.64,40.01
HOST_!DTR  (via drill 0.33)
  Top 0.254: TP12.TP 26.67,42.55 28.32,42.55 28.57,42.29 37.72,42.29 v37.85,42.42
  Bottom 0.254: v37.85,42.42 37.85,40.26 38.48,39.62 38.48,35.18 38.1,34.8 U7.32 | U1.1 24.19,44.39 24.77,43.81 24.77,43.18 TP12.TP
HOST_!RTS  (via drill 0.33)
  Top 0.254: v27.56,41.66 37.34,41.66 37.47,41.53 v38.73,41.53
  Bottom 0.254: v38.73,41.53 38.73,40.26 39.12,39.88 39.12,38.1 | 39.12,38.1 39.12,33.66 38.1,32.64 U7.1 | v27.56,41.66 27.56,42.42 26.8,43.18 26.42,43.18 24.64,45.09 21.84,45.09 21.59,44.83 21.59,44.2 22.04,43.75 U1.2 | TP11.TP 39.12,38.1
HOST_RX  (via drill 0.33)
  Top 0.254: v27.43,39.24 28.57,39.24 28.96,39.62 29.97,39.62 30.35,39.24 31.75,39.24 32,38.99 32,38.23 31.37,37.59 31.37,36.83 31.75,36.45 32.89,36.45 33.15,36.7 37.85,36.7 38.48,36.07 42.8,36.07 42.93,35.94 v44.2,35.94 | v44.45,30.23 44.45,29.97 43.18,28.7 41.53,28.7 40.77,29.46 39.24,29.46 38.73,28.96 37.21,28.96 35.05,31.11 33.53,31.11 32,29.59 v28.07,29.59 | v23.37,24.38 22.35,23.37 16.26,23.37 15.75,22.86 15.75,21.97 15.88,21.84 15.88,19.18 v16.64,18.41 | v16.64,8.13 v16.64,11.56
  Bottom 0.254: R7.1 19.18,5.21 19.18,7.11 19.05,7.24 U2.1 18.67,7.37 17.91,8.13 v16.64,8.13 | v44.2,35.94 44.83,35.31 44.83,30.61 v44.45,30.23 | v23.37,24.38 23.37,25.02 22.61,25.78 22.61,26.8 22.99,27.18 24.51,27.18 26.92,29.59 v28.07,29.59 | v16.64,18.41 16.64,17.4 16.51,17.27 16.51,17.02 15.88,16.38 15.88,12.45 v16.64,11.56 | U1.4 23.94,42.48 24.26,42.16 24.26,41.4 24.77,40.89 25.02,40.89 25.91,40.01 25.91,39.88 26.54,39.24 v27.43,39.24 27.69,39.5 27.69,40.26 28.45,41.02 28.45,43.18 27.69,43.94 27.18,43.94 26.04,45.09 TP1.TP
HOST_TX  (via drill 0.33)
  Top 0.254: v16.26,44.07 16.26,40.13 14.86,38.73 14.86,35.69 15.88,34.67 15.88,33.53 15.49,33.15 14.99,33.15 13.34,31.5 13.34,30.61 12.83,30.1 v12.83,29.72 | v12.06,26.29 13.97,26.29 14.61,26.92 18.67,26.92 20.32,25.27 21.08,25.27 22.48,26.67 23.88,26.67 24.64,27.43 26.42,27.43 26.67,27.18 TP2.TP 26.67,26.04 28.45,24.26 v28.45,23.11
  Bottom 0.254: v12.83,29.72 12.06,28.96 v12.06,26.29 | R25.1 32.77,16.76 31.88,17.65 31.88,18.03 30.86,19.05 29.08,19.05 27.56,20.57 27.56,22.23 v28.45,23.11 | U1.20 16.57,44.39 v16.26,44.07
  Bottom 0.305: U6.4 34.73,15.43 33.44,16.73 R25.1
IOREF  (via drill 0.33, 0.41)
  Top 0.254: v46.86,49.66 47.12,49.66 47.37,49.4 51.69,49.4 v51.94,49.66 | R11.1 14.95,3.85 15.24,3.56 J7.7
  Top 0.305: J7.7 16.51,1.27 43.81,1.27 44.45,1.91 44.45,3.43 44.96,3.94 53.59,3.94 56.13,6.48 56.13,6.86 57.78,8.51 57.78,13.72 57.66,13.84 57.66,17.02 58.29,17.65 58.29,25.02 v57.53,25.78
  Bottom 0.254: v46.86,49.66 46.86,48.13 R26.1 | v51.94,49.66 51.94,45.97 51.05,45.09 51.05,40.64 51.18,40.51 51.18,38.23 52.7,36.7 52.7,30.61
  Bottom 0.305: v57.53,25.78 52.7,30.61
LED_BUILTIN
  Top 0.254: 55.63,32.89 55.63,33.15 D6.K 55.66,31.66 53.21,29.21 47.88,29.21 47.12,28.45 47.12,24.89 46.61,24.38 43.56,24.38 42.04,22.86 42.04,20.7 41.53,20.19 40.13,20.19 38.46,21.86 arc45 36.67,22.61 35.85,22.61 arc45 34.05,21.86 32.89,20.7 26.67,20.7 26.29,21.08 26.29,22.1 25.27,23.11 TP4.TP
  Bottom 0.254: U7.13 29.08,30.28 29.08,29.21 28.57,28.7 27.05,28.7 25.4,27.05 25.4,23.62 TP4.TP
MGR_!RESET  (via drill 0.33)
  Top 0.254: J9.5 55.37,47.5 53.09,47.5 51.56,45.97 40.77,45.97 40.01,46.74 34.67,46.74 34.16,46.23 32.64,46.23 31.88,45.47 v31.5,45.47
  Bottom 0.254: 57.4,38.73 57.4,36.2 R29.1 | 57.4,38.73 57.66,38.99 57.66,45.21 J9.5 | 57.4,38.73 D4.A | v31.5,45.47 33.15,45.47 33.27,45.34 33.66,45.34 37.08,41.91 37.08,37.15 U7.29
MISO  (via drill 0.33)
  Top 0.254: v32.64,31.5 32.64,31.37 31.62,30.35 28.7,30.35 28.45,30.61 v27.56,30.61 | v32.51,37.21 32.77,37.47 37.85,37.47 37.85,38.73 38.35,39.24 39.62,39.24 42.16,41.78 43.81,41.78 44.45,42.16 47.12,42.16 48.13,41.15 49.78,41.15 50.55,41.91 51.56,41.91 53.34,40.13 55.37,40.13 J9.1
  Bottom 0.254: v27.56,30.61 27.56,32.13 27.94,32.51 U7.16 | v32.64,31.5 32.64,34.42 32.51,34.54 v32.51,37.21
MOSI  (via drill 0.33)
  Top 0.254: J9.4 53.09,43.81 52.45,44.45 40.64,44.45 39.5,43.31 37.47,43.31 37.08,42.93 28.83,42.93 28.57,43.18 24.77,43.18 24.51,43.43 22.99,43.43 22.86,43.31 22.86,41.78 23.75,40.89 23.75,37.08 25.15,35.69 26.8,35.69 27.3,36.2 27.3,37.21 27.81,37.72 28.57,37.72 29.08,37.21 29.08,36.45 28.96,36.32 28.96,35.81 28.07,34.92 28.07,34.54 v29.34,33.27
  Bottom 0.254: U7.15 29.34,32.8 v29.34,33.27
N$3  (via drill 0.33)
  Top 0.254: v51.56,35.94 50.93,36.58 S1.2 48.9,36.59 48.9,37.85 | v17.53,7.24 19.56,7.24 19.94,6.86 v29.84,6.86 | v47.88,5.59 49.66,7.37 49.66,21.34 v48.51,22.48 | S1.1 56.13,36.58 55.12,35.56 53.21,35.56 50.93,37.85 48.9,37.85 | 48.9,37.85 47.24,37.85 v46.35,36.96
  Bottom 0.254: v51.56,35.94 51.82,35.69 U3.8 | J7.6 17.78,3.43 17.53,3.68 v17.53,7.24 | v29.84,6.86 32.64,4.06 43.05,4.06 44.58,5.59 v47.88,5.59 | v48.51,22.48 48.26,22.48 46.48,24.26 46.48,28.7 46.74,28.96 46.74,32.26 47.37,32.89 47.37,34.92 46.99,35.31 46.61,35.31 46.35,35.56 v46.35,36.96
N$4
  Bottom 0.813: J1.1 7.95,37.39 F1.1 C1.1
N$5
  Bottom 0.813: F1.2 7.36,34.54 5.04,32.22 4.15,32.22 3.81,31.88 2.92,31.88 L1.1
N$6  (via drill 0.33)
  Top 0.254: D2.A 2.79,25.91 2.16,25.27 v2.16,24.77
  Bottom 0.254: v2.16,24.77 2.16,25.27 2.79,25.91 D2.A
N$7  (via drill 0.33)
  Top 0.254: v15.11,34.16 14.99,34.16 12.57,31.75 11.3,31.75 10.54,30.99 10.54,30.48 6.1,26.04 6.1,25.27 4.83,24 D1.K
  Bottom 0.254: v15.11,34.16 16.76,34.16 17.4,34.8 20.95,34.8 22.61,36.45 22.61,37.34 22.86,37.59 22.86,38.61 U1.10
N$8  (via drill 0.33)
  Top 0.254: v10.03,35.18 9.78,34.92 9.78,30.86 4.83,25.91 D2.K
  Bottom 0.254: v10.03,35.18 9.53,35.18 8.76,35.94 5.33,35.94 4.83,36.45 4.83,40.13 3.43,41.53 3.43,42.55 5.59,44.7 14.48,44.7 16.7,42.48 U1.17
N$10
  Bottom 0.254: R26.2 48.77,48.13 48.77,46.99 50.55,46.99 R27.2 50.55,46.1 50.42,45.97 50.42,40.39 50.55,40.26 U3.6
N$11
  Bottom 0.305: R28.2 32.64,9.4 34.04,10.79 34.04,11.89 Q4.3(D) 33.99,13.16 34.99,14.16 U6.3
N$12
  Bottom 0.305: U1.12 14.5,39.31 R1.2
N$13
  Bottom 0.305: U1.11 14.03,38.67 12.95,39.75 R12.2
N$14  (via drill 0.33)
  Top 0.254: v5.33,18.16 D3.A
  Bottom 0.254: R21.1 5.08,18.41 v5.33,18.16
N$15
  Bottom 0.254: Q2.1(G) 13.69,8.83 R10.1
N$16  (via drill 0.33)
  Top 0.254: D1.A 2.79,23.24 2.67,23.24 2.16,22.73 v2.16,22.1
  Bottom 0.254: v2.16,22.1 2.16,22.73 2.79,23.37 D1.A
N$18  (via drill 0.33)
  Top 0.254: v25.27,21.72 25.02,21.97 17.27,21.97 16.64,21.34 16.64,19.68 17.4,18.92 17.4,12.19 17.53,12.06 v17.53,10.79
  Bottom 0.254: 17.53,9.78 19.05,9.78 U2.3 | v25.27,21.72 26.58,23.03 R8.1 | 17.53,9.78 v17.53,10.79 | 17.53,9.78 Q2.3(D)
N$19
  Bottom 0.305: R15.1 17.14,15.62 17.4,15.88 17.4,16.34 R18.1 17.69,17.69 18.41,18.41 18.86,18.41 U4.1
N$20
  Bottom 0.305: U4.3 18.1,21.02 17.65,20.57 R17.1 17.02,20.45 17.02,20.11 15.58,18.66 Q3.3(D)
N$22
  Bottom 0.305: R16.1 12.13,18.07 Q3.1(G)
N$24
  Bottom 0.254: C13.1 16.64,30.86 U5.4
N$25
  Bottom 0.305: Q4.1(G) 32.7,10.99 32.89,11.18 R25.2
N$26
  Bottom 0.813: L1.2 3.72,29.88 4.57,30.73 C2.1 5.59,30.73 6.92,32.06 Q1.2(S)
N$27
  Bottom 0.305: R2.1 4.19,27.94 C2.2 5.84,28.96 C3.2 7.16,29 Q1.1(G)
N$29  (via drill 0.33)
  Top 0.254: v57.66,31.5 57.66,33.15 D6.A
  Bottom 0.254: v57.66,31.5 57.66,33.02 R35.2
RPU_AREF
  Bottom 0.254: U7.20 29.08,37.03 29.08,37.72 28.7,38.1 C18.1 28.32,38.61 28.57,38.86 28.57,40.13 29.84,41.4 29.84,43.94 28.57,45.21 TP5.TP
RX
  Bottom 0.254: J3.3 48.64,50.8 50.55,48.9 R27.1
RX_!RE
  Bottom 0.254: U6.2 36.89,12.89 37.47,13.46 37.47,16.13 39.12,17.78 40.13,17.78 41.62,19.27 41.62,19.98 41.27,20.32 R24.1 41.15,21.34 41.66,21.84 41.66,22.48 42.04,22.86 42.04,24.64 40.64,26.04 39.5,26.04 38.86,26.67 38.86,28.07 38.99,28.19 38.99,30.99 38.48,31.5 38.01,31.5 U7.2
RX_DE  (via drill 0.33)
  Top 0.254: v35.94,39.5 37.21,40.77 39.24,40.77 39.75,41.27 39.75,42.55 40.89,43.69 48.01,43.69 v48.9,42.8 | v39.24,5.59 41.91,5.59 42.8,4.7 49.53,4.7 50.42,5.59 50.42,21.72 49.91,22.23 v49.91,22.48
  Bottom 0.254: v48.9,42.8 49.91,41.78 49.91,36.45 51.18,35.18 51.18,32.64 49.66,31.11 49.66,29.46 49.4,29.21 47.88,29.21 47.12,28.45 47.12,24.77 47.88,24 48.39,24 v49.91,22.48 | v39.24,5.59 38.1,5.59 37.34,4.83 33.91,4.83 32.64,6.1 R28.1 | U7.26 35.94,39.4 v35.94,39.5
RX_RPU  (via drill 0.33)
  Top 0.254: v47.24,36.07 46.23,35.05 43.94,35.05 43.43,34.54 v43.43,32.64
  Bottom 0.254: R23.1 39.66,8.47 37.59,10.54 37.59,11.3 37.27,11.62 | U6.1 37.27,11.62 | 37.27,11.62 37.27,12.26 38.23,13.21 38.23,15.88 39.37,17.02 40.51,17.02 42.42,18.92 42.42,22.23 42.8,22.61 42.8,25.15 41.27,26.67 41.27,27.94 40.77,28.45 40.77,29.97 41.4,30.61 41.4,30.73 43.05,32.38 43.18,32.38 v43.43,32.64 | U3.5 49.28,38.1 v47.24,36.07
SCK  (via drill 0.33)
  Top 0.254: J9.3 55.12,45.21 40.39,45.21 39.5,46.1 35.43,46.1 34.67,45.47 32.89,45.47 31.88,44.45 25.53,44.45 25.27,44.7 21.72,44.7 18.54,41.53 18.54,39.88 16.76,38.1 16.76,37.34 17.14,36.96 17.91,36.96 18.41,37.47 18.41,37.59 21.97,41.15 22.61,41.15 23.11,40.64 23.11,35.69 22.73,35.31 22.73,34.29 23.75,33.27 24.51,33.27 26.04,31.75 v26.42,31.75
  Bottom 0.254: U7.17 27.94,34.67 26.92,33.66 26.92,32.13 v26.42,31.75
SCL
  Bottom 0.254: J5.1 3.56,50.55 7.49,46.61 R33.2
SCL0  (via drill 0.33)
  Top 0.254: v36.32,38.23 38.1,40.01 39.5,40.01 40.64,41.15 v40.64,41.4
  Bottom 0.254: 40.64,42.55 42.04,42.55 R31.2 | v36.32,38.23 36.32,37.59 35.81,37.08 U7.28 | 40.64,42.55 v40.64,41.4 | R33.1 10.67,46.61 12.06,48.01 27.18,47.88 27.3,47.88 28.07,48.64 29.08,48.64 30.48,47.24 32.26,47.24 33.4,46.1 33.91,46.1 36.7,43.31 38.23,43.31 38.99,42.55 40.64,42.55
SCL1  (via drill 0.33)
  Top 0.254: v37.47,25.65 38.61,25.65 39.5,24.77 TP7.TP
  Bottom 0.254: U7.6 35.81,29.16 35.81,29.08 36.58,28.32 36.58,27.3 37.47,26.42 v37.47,25.65
SDA
  Bottom 0.254: J5.2 6.1,50.16 7.62,48.64 R32.2
SDA0  (via drill 0.33)
  Top 0.254: v33.02,44.45 33.27,44.7 35.56,44.7 v36.07,45.21 36.2,45.34 38.86,45.34 v38.99,45.21 | v30.35,48.64 30.86,48.13 v33.27,48.13
  Bottom 0.254: R30.2 42.04,46.48 40.26,46.48 v38.99,45.21 | v33.02,44.45 32.89,44.32 32.89,38.99 33.02,38.86 33.02,37.85 33.91,36.96 34.62,36.96 U7.27 | v30.35,48.64 29.59,49.4 27.81,49.4 27.18,48.77 26.92,48.77 R32.1 | v33.27,48.13 34.04,47.37 34.04,47.24 v36.07,45.21
SDA1  (via drill 0.33)
  Top 0.254: v39.24,32.64 36.45,32.64 v36.32,32.77
  Bottom 0.254: v36.32,32.77 36.32,32 36.83,31.5 U7.3 | v39.24,32.64 39.75,32.13 39.75,29.97 40.01,29.72 TP6.TP
SHUTDWN  (via drill 0.33)
  Top 0.254: v30.86,32.26 30.61,32 28.7,32 26.92,33.78 25.53,33.78 24.51,34.8 TP8.TP
  Bottom 0.254: U7.12 30.86,30.93 v30.86,32.26
TX  (via drill 0.33, 0.41)
  Top 0.254: v15.11,46.86 15.11,43.69 15.49,43.31 15.49,40.39 14.22,39.12 14.22,34.29 12.45,32.51 11.18,32.51 10.92,32.77 10.92,35.69 10.41,36.2 9.65,36.2 8.76,35.31 8.76,30.99 5.21,27.43 1.91,27.43 1.27,26.8 1.27,21.46 2.03,20.7 4.32,20.7 6.48,18.54 9.4,18.54 10.16,17.78 11.68,17.78 14.1,15.37 14.1,8.38 v14.73,7.75 | v22.86,46.99 24,48.13 26.67,48.13 28.07,49.53 33.91,49.53 34.67,48.77 40.64,48.77 41.78,47.62 v44.07,47.62 | R11.2 12.99,4.53 v13.97,3.56
  Bottom 0.254: J3.4 44.07,49.15 v44.07,47.62 44.07,43.69 44.45,43.31 44.45,42.29 44.2,42.04 U3.1 | v15.11,46.86 15.49,47.24 22.61,47.24 v22.86,46.99 | v14.73,7.75 13.76,6.77 R10.2 13.59,5.71 13.97,5.33 v13.97,3.56
TX_!RE  (via drill 0.33)
  Top 0.254: v33.91,43.81 33.78,43.56 29.08,43.56 28.83,43.81 25.15,43.81 24.89,44.07 22.48,44.07 22.23,43.81 22.23,42.42 17.65,37.85 v17.53,37.85 | v10.29,19.05 10.03,19.3 6.73,19.3 5.46,20.57 5.46,22.23 6.1,22.86 6.1,24.13 v7.11,25.15
  Bottom 0.254: v33.91,43.81 33.91,43.43 33.53,43.05 33.53,39.5 33.91,39.12 33.91,38.86 34.04,38.73 U7.25 | v17.53,37.85 12.06,37.85 12.06,34.29 11.81,34.04 11.81,31.88 11.3,31.37 11.05,31.37 10.54,30.86 10.54,30.1 10.79,29.84 11.05,29.84 11.3,29.59 11.3,27.18 10.79,26.67 8.64,26.67 v7.11,25.15 | U2.2 18.35,8.57 18.03,8.89 16.51,8.89 16.38,9.02 16.38,9.4 16,9.78 14.61,9.78 14.48,9.91 13.34,9.91 12.7,10.54 12.7,14.86 10.29,17.27 v10.29,19.05
  Bottom 0.305: R6.2 23.15,5.55 22.1,6.6 21.59,6.6 19.62,8.57 U2.2
TX_DE
  Bottom 0.254: U7.9 29.72,26.39 29.72,25.91 28.57,24.77 R8.2
TX_RPU  (via drill 0.33)
  Top 0.254: v45.85,23.5 43.56,23.5 42.67,22.61 42.67,20.07 42.04,19.43 39.88,19.43 38.21,21.1 arc45 36.41,21.84 36.1,21.84 arc45 34.31,21.1 33.27,20.07 25.65,20.07 24.38,21.34 18.03,21.34 17.65,20.95 17.65,19.81 18.03,19.43 18.03,14.73 18.54,14.22 v18.54,12.19
  Bottom 0.254: U3.2 45.47,35.43 46.1,34.8 46.1,29.08 45.85,28.83 v45.85,23.5 | v18.54,12.19 18.92,11.81 19.05,11.81
  Bottom 0.305: U2.4 19.05,11.81 19.94,12.7 R9.2
USB5V_ADC6  (via drill 0.33)
  Top 0.254: v28.19,36.83 28.19,36.07 v26.8,34.67 | v23.75,32 23.75,31.5 20.19,27.94 19.05,27.94 18.67,27.56 14.22,27.56 13.72,27.05 11.56,27.05 11.05,26.54 11.05,25.78 11.94,24.89 11.94,23.37 9.91,21.34 v7.49,21.34
  Bottom 0.254: 6.73,20.19 C5.1 | v23.75,32 24.13,32 v26.8,34.67 | 6.73,20.19 6.73,20.57 | 6.73,20.57 v7.49,21.34 | 6.73,20.19 R4.1 6.73,20.57 | 6.73,20.57 R3.1 | U7.19 28.19,36.78 v28.19,36.83
XTAL1
  Bottom 0.254: U7.7 35.18,28.67 35.18,27.94 34.29,27.05 C20.1 34.29,24.77 35.69,23.37 36.91,23.37 Y1.1
XTAL2
  Bottom 0.254: U7.8 34.08,28.54 34.16,28.45 34.16,28.07 33.02,26.92 C21.1 33.02,24.38 33.53,23.88 33.53,23.37 33.27,23.11 Y1.2

### Text on the board
tPlace: SCL | SDA | 0V | 13 | 12 | 11 | 10 | 9 | 8 | 7 | 6 | 5 | 4 | 3 | 2 | TX | RX | !RST | RPU_AREF | 0V | FTDI_RX | SCK | MNG_ICSP | MOSI | FTDI_!DTR | MISO | RPUftdi | 3V3 | FTDI_!DSR | FTDI_!CTS | FTDI_3V3 | FTDI / _!RTS | DTR / RXD | ICP1 | MNG_LED | RD | RPUBUS.ORG | MISO | 14145^4 | IOREF | SCK | USBRX | SDA1 | MOSI | FTDI_TX | !RESET | YE | 0V | OC1A | RD | SCL1 | USBTX | DTR / TXD | 100Ω / TERM- / INATIONS | GN | 5V | 5V | +RX | -RX | +DTR | -DTR | !RESET | +TX | -TX | IOREF | 3V3 | 5V | 0V | 0V | VIN | ADC2 | ADC4 | ADC6 | ADC0 | ADC1 | ADC3 | ADC5 | ADC7 | 0V
bPlace: RPUBUS.ORG | RPUftdi